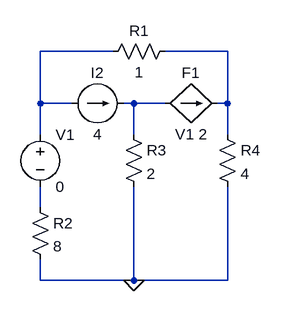
[diagram p0: schematic Draft11.asc]
Draft11.asc, the LTspice schematic file:
Version 4
SHEET 1 880 680
WIRE 96 48 -16 48
WIRE 272 48 176 48
WIRE -16 128 -16 48
WIRE 32 128 -16 128
WIRE 128 128 112 128
WIRE 176 128 128 128
WIRE 272 128 272 48
WIRE 272 128 256 128
WIRE -16 176 -16 128
WIRE 128 176 128 128
WIRE 272 176 272 128
WIRE -16 288 -16 256
WIRE -16 400 -16 368
WIRE 128 400 128 256
WIRE 128 400 -16 400
WIRE 272 400 272 256
WIRE 272 400 128 400
FLAG 128 400 0
SYMBOL res 192 32 R90
WINDOW 0 0 56 VBottom 2
WINDOW 3 32 56 VTop 2
SYMATTR InstName R1
SYMATTR Value 1
SYMBOL res 112 160 R0
SYMATTR InstName R3
SYMATTR Value 2
SYMBOL res 256 160 R0
SYMATTR InstName R4
SYMATTR Value 4
SYMBOL current 32 128 R270
WINDOW 0 32 40 VTop 2
WINDOW 3 -32 40 VBottom 2
SYMATTR InstName I2
SYMATTR Value 4
SYMBOL f 176 128 R270
WINDOW 0 32 40 VTop 2
WINDOW 3 -32 40 VBottom 2
SYMATTR InstName F1
SYMATTR Value V1 2
SYMBOL voltage -16 160 R0
SYMATTR InstName V1
SYMATTR Value 0
SYMBOL res -32 272 R0
SYMATTR InstName R2
SYMATTR Value 8

The netlist it stands for:
* Draft11.asc
R1 N002 N001 1
R3 N003 0 2
R4 N002 0 4
I2 N001 N003 4
F1 N003 N002 V1 2
V1 N001 N004 0
R2 N004 0 8
.backanno
.end